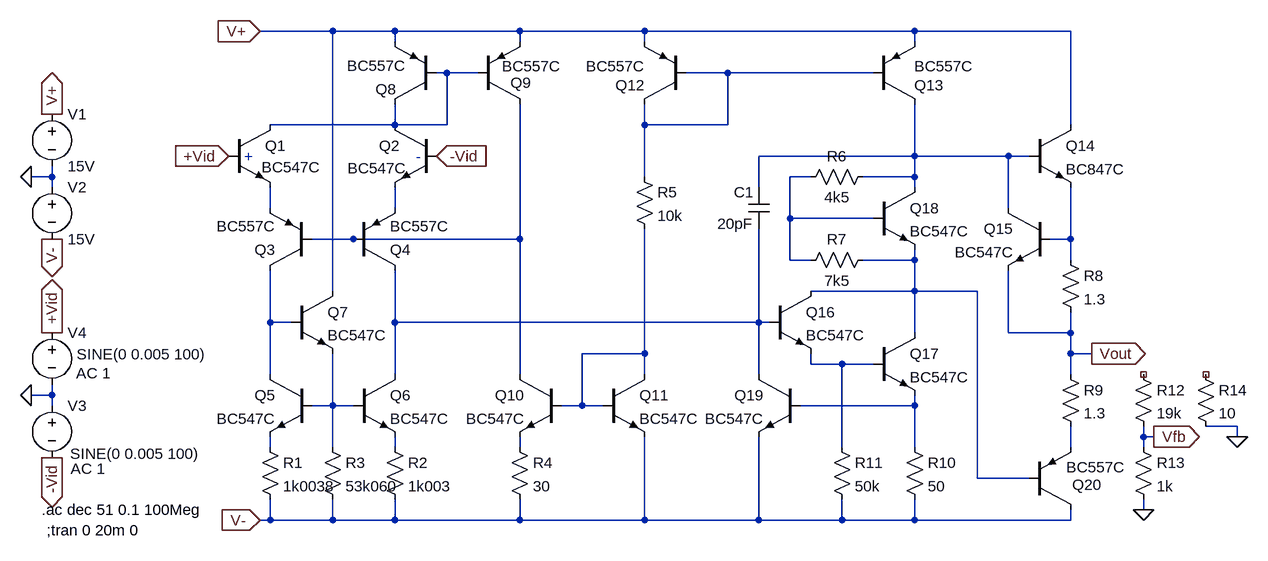
[diagram p0: schematic LM741_BJT.asc]
LM741_BJT.asc, the LTspice schematic file:
Version 4
SHEET 1 3216 1092
WIRE 256 -16 144 -16
WIRE 352 -16 256 -16
WIRE 544 -16 352 -16
WIRE 736 -16 544 -16
WIRE 1152 -16 736 -16
WIRE 1392 -16 1152 -16
WIRE 352 0 352 -16
WIRE 544 0 544 -16
WIRE 736 0 736 -16
WIRE 1152 0 1152 -16
WIRE 432 48 416 48
WIRE 480 48 432 48
WIRE 864 48 800 48
WIRE 1088 48 864 48
WIRE 352 128 352 96
WIRE 352 128 160 128
WIRE 432 128 432 48
WIRE 432 128 352 128
WIRE 736 128 736 96
WIRE 864 128 864 48
WIRE 864 128 736 128
WIRE 1392 128 1392 -16
WIRE 1152 176 1152 96
WIRE 1152 176 912 176
WIRE 1296 176 1152 176
WIRE 1328 176 1296 176
WIRE -176 208 -176 192
WIRE -176 208 -208 208
WIRE 736 208 736 128
WIRE 992 208 960 208
WIRE 1152 208 1152 176
WIRE 1152 208 1072 208
WIRE -176 224 -176 208
WIRE 912 224 912 176
WIRE 1152 224 1152 208
WIRE 160 256 160 224
WIRE 352 256 352 224
WIRE 1296 256 1296 176
WIRE 960 272 960 208
WIRE 1088 272 960 272
WIRE 288 304 224 304
WIRE 544 304 544 96
WIRE 544 304 288 304
WIRE 1392 304 1392 224
WIRE 1392 304 1360 304
WIRE 960 336 960 272
WIRE 992 336 960 336
WIRE 1152 336 1152 320
WIRE 1152 336 1072 336
WIRE 1392 336 1392 304
WIRE 256 384 256 -16
WIRE 1152 384 1152 336
WIRE 1152 384 992 384
WIRE 1248 384 1152 384
WIRE 160 432 160 352
WIRE 192 432 160 432
WIRE 352 432 352 352
WIRE 912 432 912 288
WIRE 912 432 352 432
WIRE 928 432 912 432
WIRE 1152 448 1152 384
WIRE 1296 448 1296 352
WIRE 1392 448 1392 416
WIRE 1392 448 1296 448
WIRE 736 480 736 288
WIRE 736 480 640 480
WIRE 1392 480 1392 448
WIRE 1424 480 1392 480
WIRE 992 496 992 480
WIRE 1040 496 992 496
WIRE 1088 496 1040 496
WIRE 160 512 160 432
WIRE 352 512 352 432
WIRE 544 512 544 304
WIRE 736 512 736 480
WIRE 912 512 912 432
WIRE 1392 512 1392 480
WIRE -176 544 -176 528
WIRE -176 544 -208 544
WIRE -176 560 -176 544
WIRE 256 560 256 480
WIRE 256 560 224 560
WIRE 288 560 256 560
WIRE 640 560 640 480
WIRE 640 560 608 560
WIRE 672 560 640 560
WIRE 1152 560 1152 544
WIRE 1152 560 976 560
WIRE 1648 592 1600 592
WIRE 1504 608 1504 592
WIRE 1520 608 1504 608
WIRE 1648 608 1648 592
WIRE 160 624 160 608
WIRE 256 624 256 560
WIRE 352 624 352 608
WIRE 544 624 544 608
WIRE 1040 624 1040 496
WIRE 1152 624 1152 560
WIRE 1392 624 1392 592
WIRE 1504 624 1504 608
WIRE 1248 672 1248 384
WIRE 1328 672 1248 672
WIRE 1504 720 1504 704
WIRE 160 736 160 704
WIRE 160 736 144 736
WIRE 256 736 256 704
WIRE 256 736 160 736
WIRE 352 736 352 704
WIRE 352 736 256 736
WIRE 544 736 544 704
WIRE 544 736 352 736
WIRE 736 736 736 608
WIRE 736 736 544 736
WIRE 912 736 912 608
WIRE 912 736 736 736
WIRE 1040 736 1040 704
WIRE 1040 736 912 736
WIRE 1152 736 1152 704
WIRE 1152 736 1040 736
WIRE 1392 736 1392 720
WIRE 1392 736 1152 736
FLAG 1424 480 Vout
IOPIN 1424 480 Out
FLAG 144 -16 V+
IOPIN 144 -16 In
FLAG 144 736 V-
IOPIN 144 736 In
FLAG -208 208 0
FLAG -176 112 V+
IOPIN -176 112 Out
FLAG -176 304 V-
IOPIN -176 304 Out
FLAG -176 448 +Vid
IOPIN -176 448 Out
FLAG -176 640 -Vid
IOPIN -176 640 Out
FLAG -208 544 0
FLAG 1504 720 0
FLAG 1520 608 Vfb
IOPIN 1520 608 Out
FLAG 1648 608 0
FLAG 96 176 +Vid
IOPIN 96 176 In
FLAG 416 176 -Vid
IOPIN 416 176 In
SYMBOL npn 96 128 R0
WINDOW 3 51 65 Left 2
SYMATTR Value BC547C
SYMATTR InstName Q1
SYMBOL npn 416 128 M0
WINDOW 3 46 67 Left 2
SYMATTR Value BC547C
SYMATTR InstName Q2
SYMBOL pnp 224 352 R180
SYMATTR InstName Q3
SYMATTR Value BC557C
SYMBOL pnp 288 352 M180
SYMATTR InstName Q4
SYMATTR Value BC557C
SYMBOL npn 224 512 M0
SYMATTR InstName Q5
SYMATTR Value BC547C
SYMBOL npn 288 512 R0
SYMATTR InstName Q6
SYMATTR Value BC547C
SYMBOL npn 192 384 R0
SYMATTR InstName Q7
SYMATTR Value BC547C
SYMBOL pnp 416 96 R180
WINDOW 0 62 23 Left 2
WINDOW 3 47 59 Left 2
SYMATTR InstName Q8
SYMATTR Value BC557C
SYMBOL pnp 480 96 M180
WINDOW 0 50 33 Left 2
WINDOW 3 37 58 Left 2
SYMATTR InstName Q9
SYMATTR Value BC557C
SYMBOL npn 608 512 M0
SYMATTR InstName Q10
SYMATTR Value BC547C
SYMBOL npn 672 512 R0
SYMATTR InstName Q11
SYMATTR Value BC547C
SYMBOL res 144 608 R0
SYMATTR InstName R1
SYMATTR Value 1k0038
SYMBOL res 336 608 R0
SYMATTR InstName R2
SYMATTR Value 1k003
SYMBOL res 240 608 R0
SYMATTR InstName R3
SYMATTR Value 53k060
SYMBOL res 528 608 R0
SYMATTR InstName R4
SYMATTR Value 30
SYMBOL res 720 192 R0
SYMATTR InstName R5
SYMATTR Value 10k
SYMBOL pnp 800 96 R180
WINDOW 0 63 29 Left 2
WINDOW 3 63 58 Left 2
SYMATTR InstName Q12
SYMATTR Value BC557C
SYMBOL pnp 1088 96 M180
WINDOW 0 63 29 Left 2
WINDOW 3 63 58 Left 2
SYMATTR InstName Q13
SYMATTR Value BC557C
SYMBOL npn 1360 256 M0
SYMATTR InstName Q15
SYMATTR Value BC547C
SYMBOL npn 928 384 R0
SYMATTR InstName Q16
SYMATTR Value BC547C
SYMBOL npn 1088 448 R0
SYMATTR InstName Q17
SYMATTR Value BC547C
SYMBOL npn 1088 224 R0
SYMATTR InstName Q18
SYMATTR Value BC547C
SYMBOL npn 976 512 M0
SYMATTR InstName Q19
SYMATTR Value BC547C
SYMBOL cap 928 224 M0
SYMATTR InstName C1
SYMATTR Value 20pF
SYMBOL res 1088 192 R90
WINDOW 0 0 56 VBottom 2
WINDOW 3 32 56 VTop 2
SYMATTR InstName R6
SYMATTR Value 4k5
SYMBOL res 1088 320 R90
WINDOW 0 0 56 VBottom 2
WINDOW 3 32 56 VTop 2
SYMATTR InstName R7
SYMATTR Value 7k5
SYMBOL res 1376 320 R0
SYMATTR InstName R8
SYMATTR Value 1.3
SYMBOL res 1136 608 R0
SYMATTR InstName R10
SYMATTR Value 50
SYMBOL res 1024 608 R0
SYMATTR InstName R11
SYMATTR Value 50k
SYMBOL npn 1328 128 R0
SYMATTR InstName Q14
SYMATTR Value BC847C
SYMBOL res 1376 496 R0
SYMATTR InstName R9
SYMATTR Value 1.3
SYMBOL pnp 1328 720 M180
WINDOW 0 66 38 Left 2
WINDOW 3 57 65 Left 2
SYMATTR InstName Q20
SYMATTR Value BC557C
SYMBOL voltage -176 96 R0
WINDOW 123 0 0 Left 0
WINDOW 39 0 0 Left 0
SYMATTR InstName V1
SYMATTR Value 15V
SYMBOL voltage -176 208 R0
WINDOW 123 0 0 Left 0
WINDOW 39 0 0 Left 0
SYMATTR InstName V2
SYMATTR Value 15V
SYMBOL voltage -176 432 R0
WINDOW 123 37 78 Left 2
WINDOW 39 0 0 Left 0
WINDOW 3 38 49 Left 2
SYMATTR Value2 AC 1
SYMATTR Value SINE(0 0.005 100)
SYMATTR InstName V4
SYMBOL voltage -176 544 R0
WINDOW 123 29 113 Left 2
WINDOW 39 0 0 Left 0
WINDOW 3 28 90 Left 2
SYMATTR Value2 AC 1
SYMATTR Value SINE(0 0.005 100)
SYMATTR InstName V3
SYMBOL res 1488 496 R0
SYMATTR InstName R12
SYMATTR Value 19k
SYMBOL res 1488 608 R0
SYMATTR InstName R13
SYMATTR Value 1k
SYMBOL res 1584 496 R0
SYMATTR InstName R14
SYMATTR Value 10
TEXT -192 720 Left 2 !.ac dec 51 0.1 100Meg
TEXT -184 752 Left 2 !;tran 0 20m 0
TEXT 120 176 Left 2 ;+
TEXT 384 176 Left 2 ;-

The netlist it stands for:
* LM741_BJT.asc
Q1 N001 +Vid N005 0 BC547C
Q2 N001 -Vid N006 0 BC547C
Q3 N010 N007 N005 0 BC557C
Q4 N011 N007 N006 0 BC557C
Q5 N010 N014 N016 0 BC547C
Q6 N011 N014 N017 0 BC547C
Q7 V+ N010 N014 0 BC547C
Q8 N001 N001 V+ 0 BC557C
Q9 N007 N001 V+ 0 BC557C
Q10 N007 N012 N018 0 BC547C
Q11 N012 N012 V- 0 BC547C
R1 N016 V- 1k0038
R2 N017 V- 1k003
R3 N014 V- 53k060
R4 N018 V- 30
R5 N002 N012 10k
Q12 N002 N002 V+ 0 BC557C
Q13 N003 N002 V+ 0 BC557C
Q15 N003 N008 Vout 0 BC547C
Q16 N009 N011 N013 0 BC547C
Q17 N009 N013 N015 0 BC547C
Q18 N003 N004 N009 0 BC547C
Q19 N011 N015 V- 0 BC547C
C1 N003 N011 20pF
R6 N003 N004 4k5
R7 N009 N004 7k5
R8 N008 Vout 1.3
R10 N015 V- 50
R11 N013 V- 50k
Q14 V+ N003 N008 0 BC847C
R9 Vout N019 1.3
Q20 V- N009 N019 0 BC557C
V1 V+ 0 15V
V2 0 V- 15V
V4 +Vid 0 SINE(0 0.005 100) AC 1
V3 0 -Vid SINE(0 0.005 100) AC 1
R12 NC_01 Vfb 19k
R13 Vfb 0 1k
R14 NC_02 0 10
.model NPN NPN
.model PNP PNP
.lib standard.bjt
.ac dec 51 0.1 100Meg
;tran 0 20m 0
* +
* -
.backanno
.end